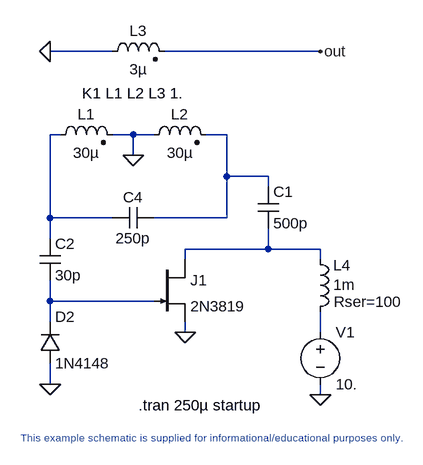
[diagram p0: schematic Hartly.asc]
Hartly.asc, the LTspice schematic file:
Version 4
SHEET 1 2764 2344
WIRE 2080 1664 1984 1664
WIRE 2400 1664 2160 1664
WIRE 2000 1792 1984 1792
WIRE 2112 1792 2080 1792
WIRE 2144 1792 2112 1792
WIRE 2256 1792 2224 1792
WIRE 2112 1824 2112 1792
WIRE 2256 1856 2256 1792
WIRE 2320 1856 2256 1856
WIRE 2320 1872 2320 1856
WIRE 1984 1920 1984 1792
WIRE 2080 1920 1984 1920
WIRE 2256 1920 2256 1856
WIRE 2256 1920 2144 1920
WIRE 1984 1952 1984 1920
WIRE 2320 1968 2320 1936
WIRE 2320 1968 2192 1968
WIRE 2400 1968 2320 1968
WIRE 2192 1984 2192 1968
WIRE 2400 1984 2400 1968
WIRE 1984 2048 1984 2016
WIRE 2144 2048 1984 2048
WIRE 1984 2080 1984 2048
WIRE 2192 2096 2192 2080
WIRE 2400 2096 2400 2064
WIRE 1984 2176 1984 2144
WIRE 2400 2192 2400 2176
FLAG 2400 2192 0
FLAG 2192 2096 0
FLAG 2112 1824 0
FLAG 1984 2176 0
FLAG 1984 1664 0
FLAG 2400 1664 out
SYMBOL njf 2144 1984 R0
SYMATTR InstName J1
SYMATTR Value 2N3819
SYMBOL voltage 2400 2080 R0
SYMATTR InstName V1
SYMATTR Value 10.
SYMBOL cap 2144 1904 R90
WINDOW 0 0 32 VBottom 2
WINDOW 3 32 32 VTop 2
SYMATTR InstName C4
SYMATTR Value 250p
SYMBOL ind 2384 1968 R0
WINDOW 0 36 25 Left 2
WINDOW 3 36 55 Left 2
WINDOW 39 37 81 Left 2
SYMATTR InstName L4
SYMATTR Value 1m
SYMATTR SpiceLine Rser=100
SYMBOL ind2 2128 1808 R270
WINDOW 0 32 56 VTop 2
WINDOW 3 4 56 VBottom 2
SYMATTR InstName L2
SYMATTR Value 30µ
SYMBOL ind2 1984 1808 R270
WINDOW 0 32 56 VTop 2
WINDOW 3 4 56 VBottom 2
SYMATTR InstName L1
SYMATTR Value 30µ
SYMBOL cap 2304 1872 R0
SYMATTR InstName C1
SYMATTR Value 500p
SYMBOL cap 1968 1952 R0
SYMATTR InstName C2
SYMATTR Value 30p
SYMBOL diode 1968 2144 M180
WINDOW 0 24 72 Left 2
WINDOW 3 24 0 Left 2
SYMATTR InstName D2
SYMATTR Value 1N4148
SYMBOL ind2 2064 1680 R270
WINDOW 0 32 56 VTop 2
WINDOW 3 4 56 VBottom 2
SYMATTR InstName L3
SYMATTR Value 3µ
TEXT 2120 2208 Left 2 !.tran 250µ startup
TEXT 2112 1728 Center 2 !K1 L1 L2 L3 1.
TEXT 2224 2248 Top 1 ;This example schematic is supplied for informational/educational purposes only.

The netlist it stands for:
* Hartly.asc
J1 N003 N004 0 2N3819
V1 N005 0 10.
C4 N002 N001 250p
L4 N003 N005 1m Rser=100
L2 0 N002 30µ
L1 N001 0 30µ
C1 N002 N003 500p
C2 N001 N004 30p
D2 0 N004 1N4148
L3 0 out 3µ
.model D D
.lib standard.dio
.model NJF NJF
.model PJF PJF
.lib standard.jft
.tran 250µ startup
K1 L1 L2 L3 1.
* This example schematic is supplied for informational/educational purposes only.
.backanno
.end